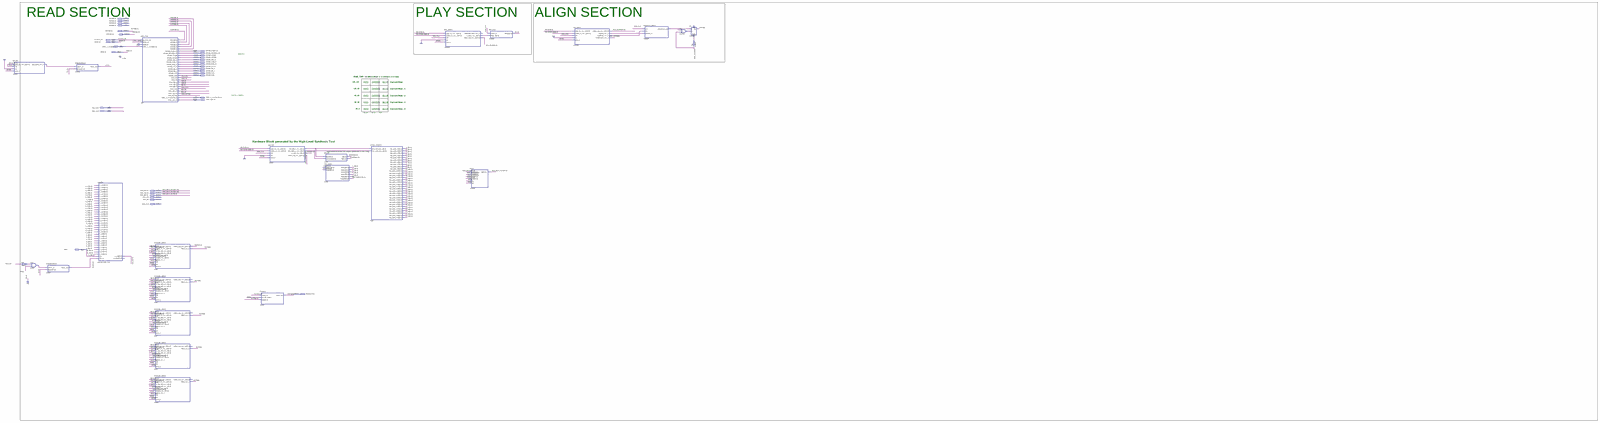
[diagram p0: schematic sheet, whole]
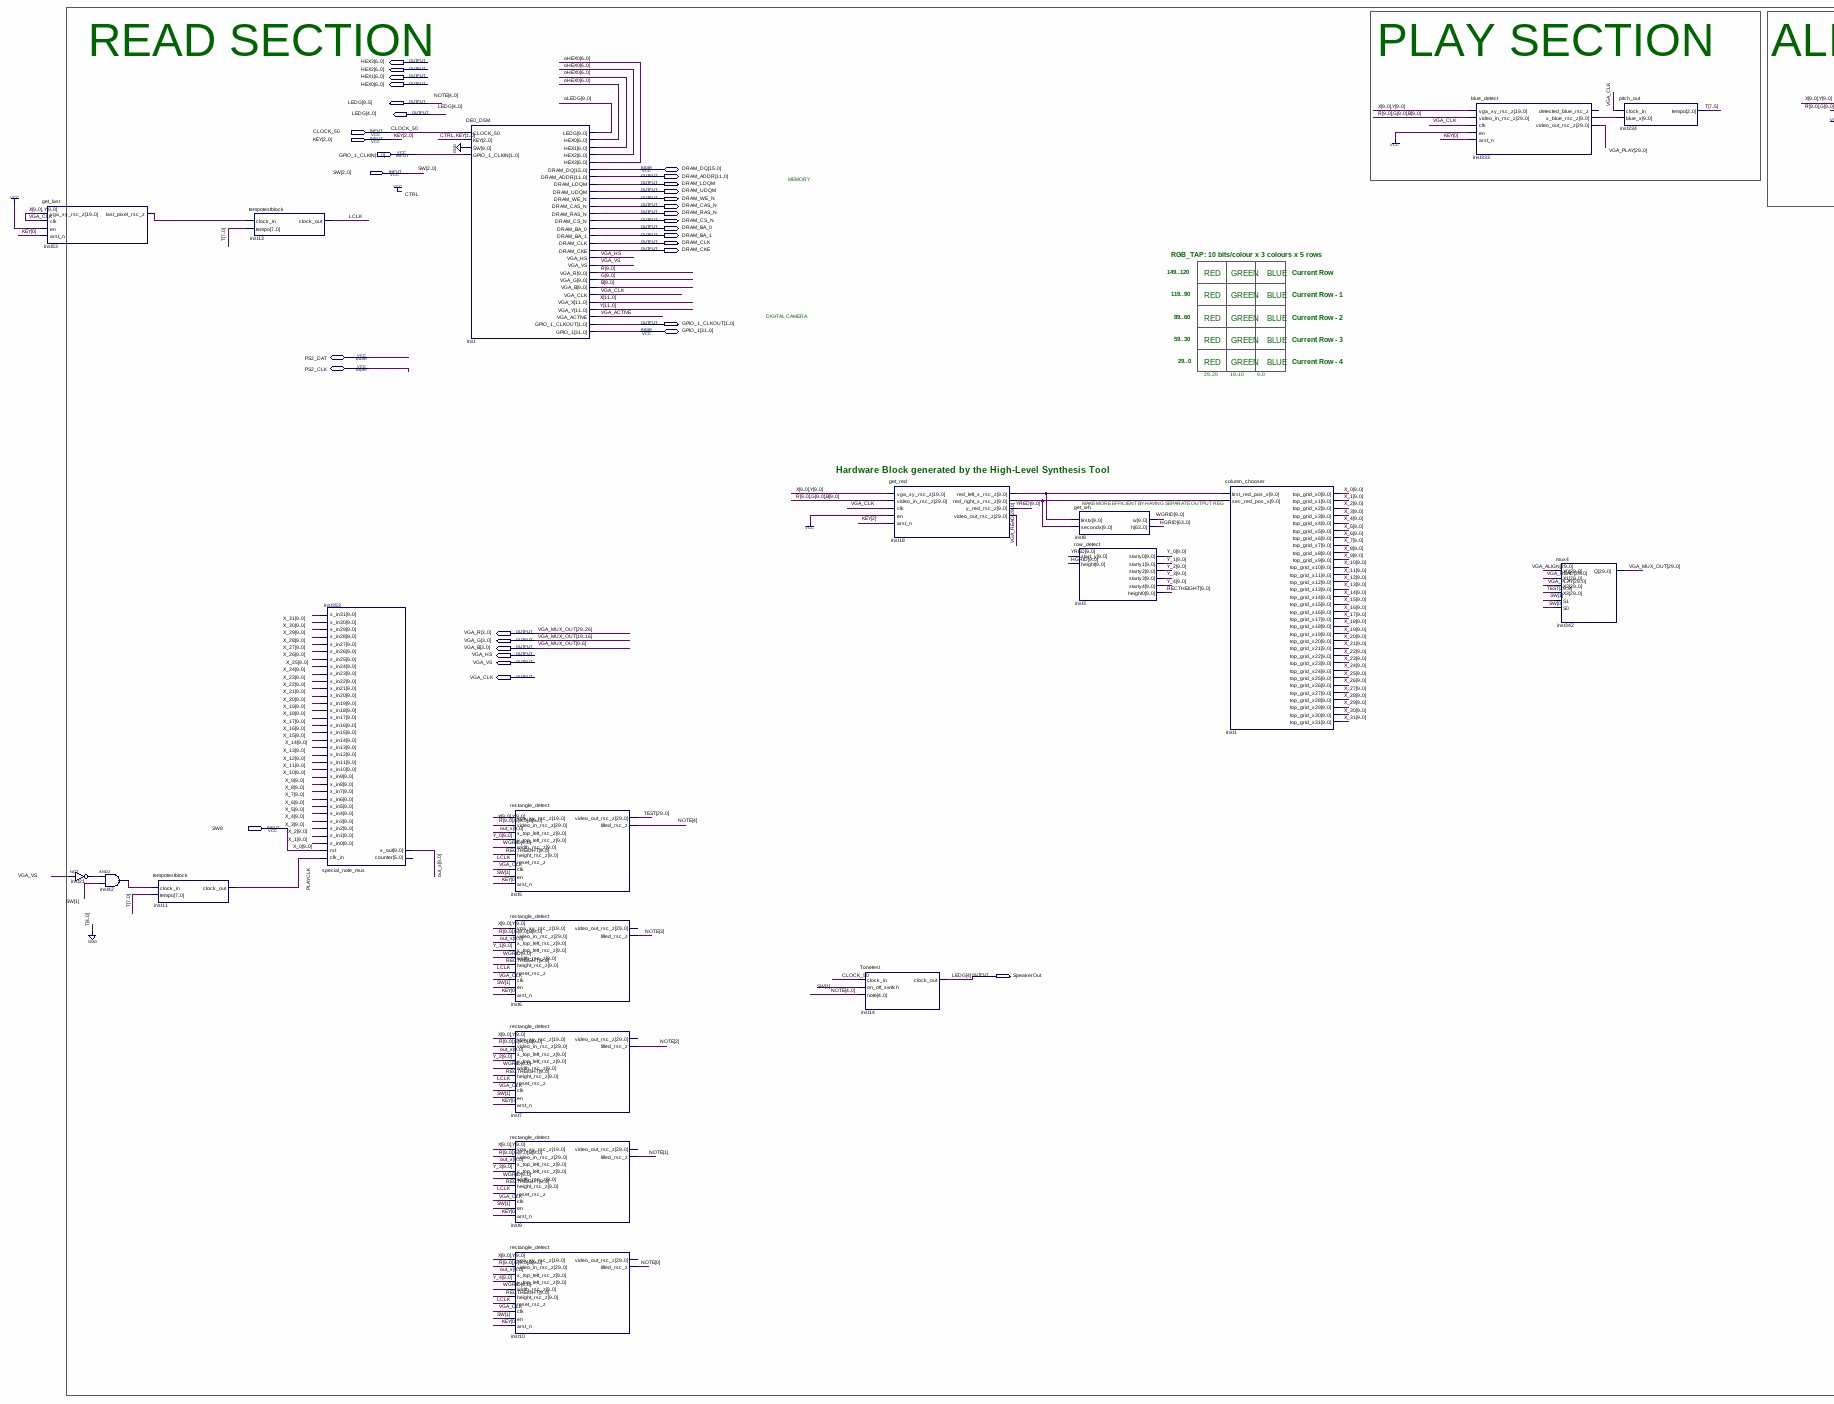
[diagram p1: schematic sheet, left part]
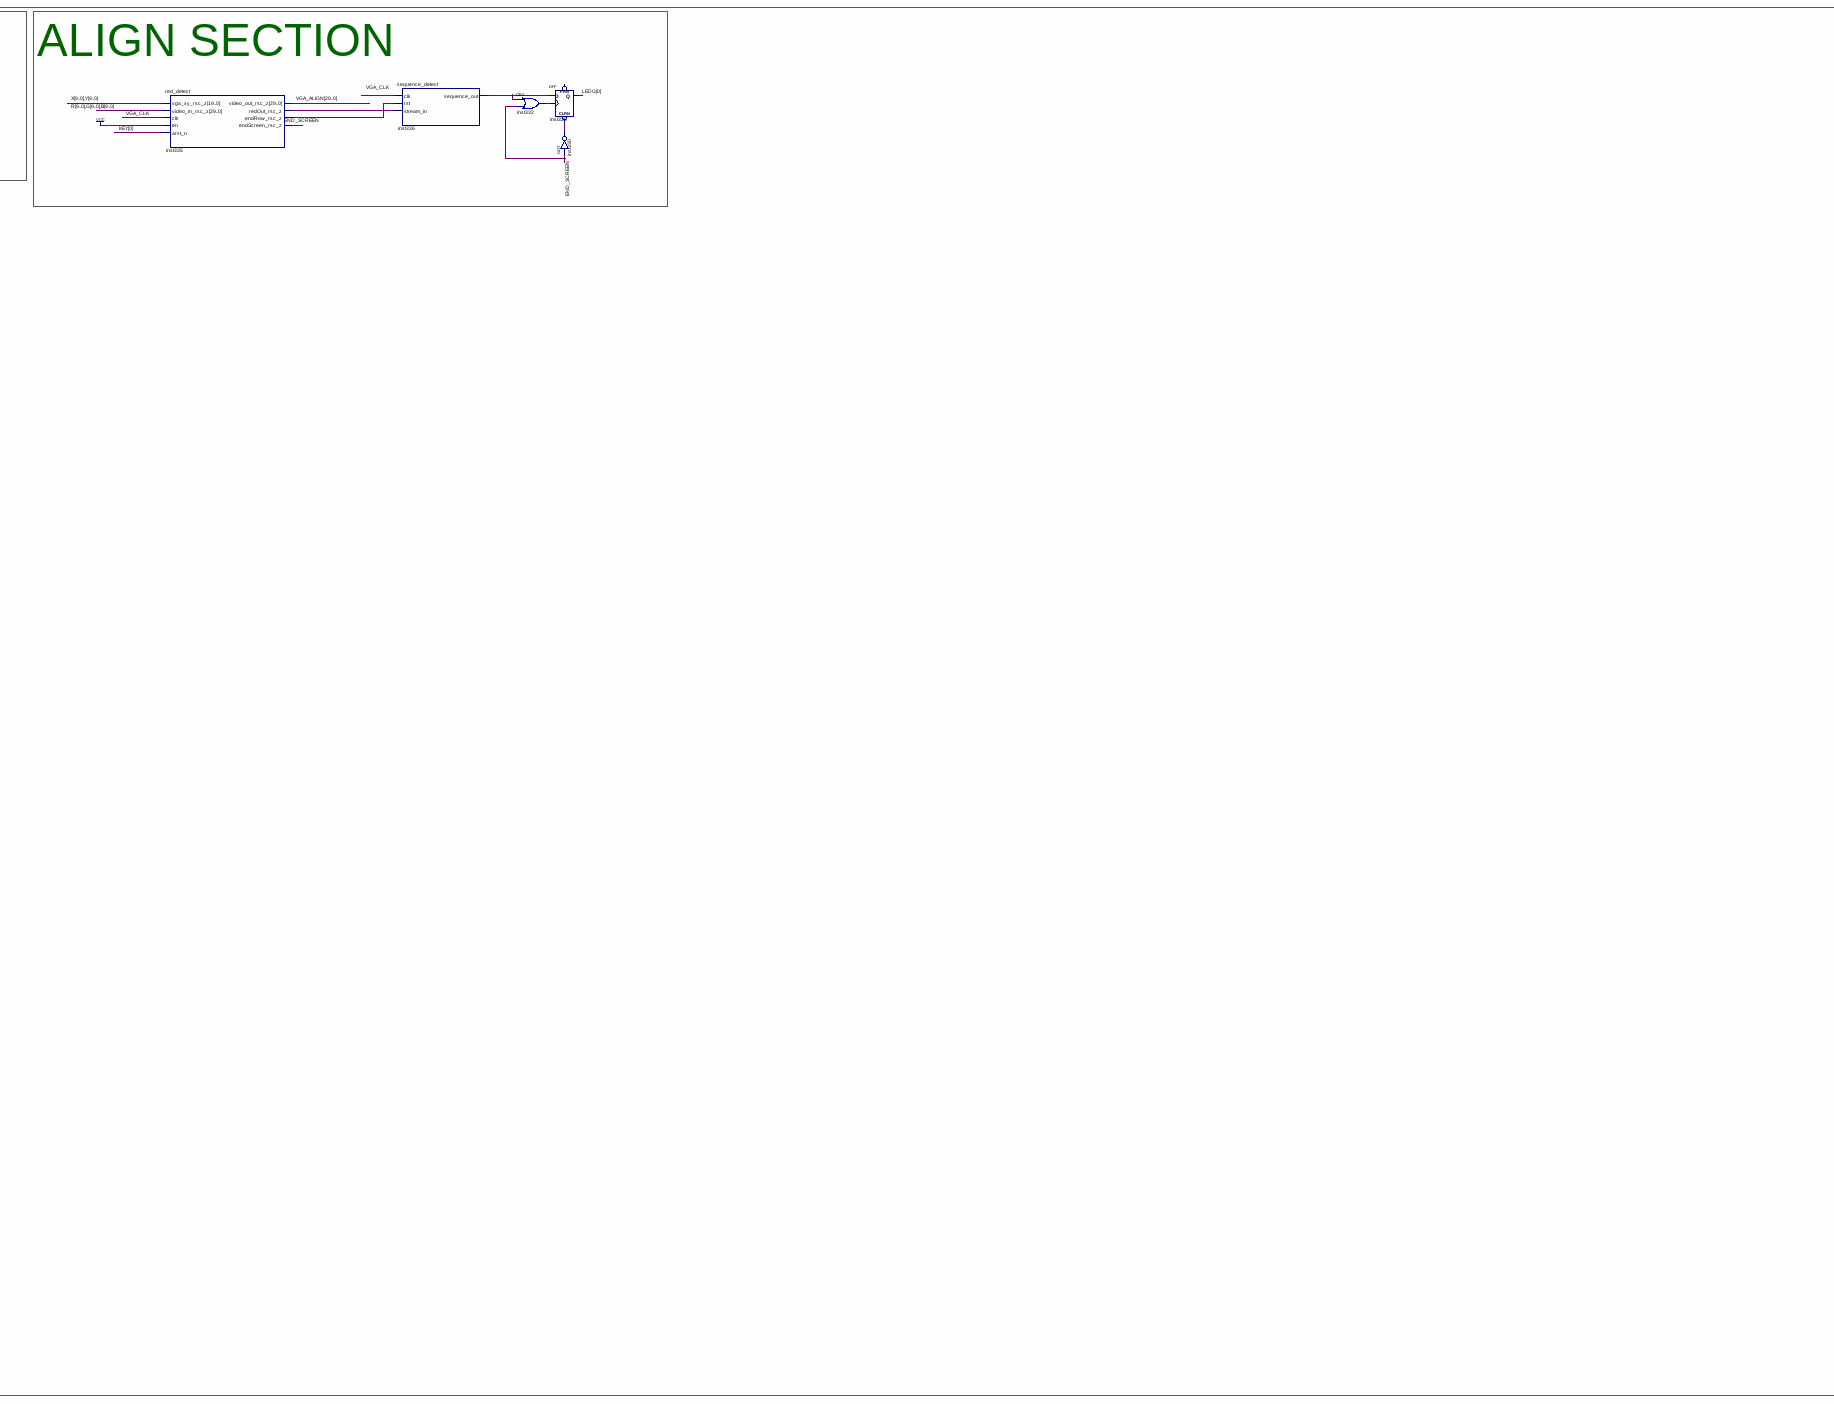
[diagram p2: schematic sheet, centre part]
// Quartus schematic TOP_DE0_CAMERA_MOUSE.bdf as structural Verilog: 25 symbols, 34 pins
module TOP_DE0_CAMERA_MOUSE (
  input  CLOCK_50,
  input  [2:0] KEY,
  input  [1:0] GPIO_1_CLKIN,
  input  [2:0] SW,
  input  SW8,
  inout  [15:0] DRAM_DQ,
  inout  [31:0] GPIO_1,
  inout  PS2_DAT,
  inout  PS2_CLK,
  output [6:0] HEX3,
  output [6:0] HEX2,
  output [6:0] HEX1,
  output [6:0] HEX0,
  output [9:0] LEDG,
  output [11:0] DRAM_ADDR,
  output DRAM_LDQM,
  output DRAM_UDQM,
  output DRAM_WE_N,
  output DRAM_CAS_N,
  output DRAM_RAS_N,
  output DRAM_CS_N,
  output DRAM_BA_0,
  output DRAM_BA_1,
  output DRAM_CLK,
  output DRAM_CKE,
  output [1:0] GPIO_1_CLKOUT,
  output [3:0] VGA_R,
  output [3:0] VGA_G,
  output [3:0] VGA_B,
  output VGA_HS,
  output VGA_VS,
  output VGA_CLK,
  output SpeakerOut
);

  wire END_SCREEN, inst21_out, inst42_out, inst53_last_pixel_rsc_z, inst330_out, inst332_out,
       inst335_endrow_rsc_z, inst335_redout_rsc_z, inst336_sequence_out, LCLK, PLAYCLK, VGA_ACTIVE;
  wire [6:0] oHEX0;
  wire [7:5] T;
  wire [9:0] B, G, inst18_red_left_x_rsc_z, inst18_red_right_x_rsc_z, inst333_x_blue_rsc_z, oLEDG, out_x, R,
       RECTHEIGHT, WGRID, X_0, X_1, X_2, X_3, X_4, X_5, X_6, X_7, X_8, X_9, X_10, X_11, X_12, X_13, X_14,
       X_15, X_16, X_17, X_18, X_19, X_20, X_21, X_22, X_23, X_24, X_25, X_26, X_27, X_28, X_29, X_30, X_31,
       Y_0, Y_1, Y_2, Y_3, Y_4, YRED;
  wire [11:0] X, Y;
  wire [25:0] VGA_MUX_OUT;
  wire [29:0] TEST, VGA_ALIGN, VGA_PLAY, VGA_READ;
  wire [63:0] HGRID;

  get_last inst53 (
    .vga_xy_rsc_z({X[9:0], Y[9:0]}), .clk(VGA_CLK), .en(1'b1), .arst_n(KEY[0]),
    .last_pixel_rsc_z(inst53_last_pixel_rsc_z));
  not inst21 (inst21_out, VGA_VS);
  and inst42 (inst42_out, inst21_out, SW[1]);
  tempotestblock inst11 (.clock_in(inst42_out), .tempo({T, {5{1'b0}}}), .clock_out(PLAYCLK));
  tempotestblock inst13 (.clock_in(inst53_last_pixel_rsc_z), .tempo({T, {5{1'b0}}}), .clock_out(LCLK));
  special_note_mux inst353 (
    .clk_in(PLAYCLK), .rst(SW8), .x_in0(X_0), .x_in1(X_1), .x_in2(X_2), .x_in3(X_3), .x_in4(X_4),
    .x_in5(X_5), .x_in6(X_6), .x_in7(X_7), .x_in8(X_8), .x_in9(X_9), .x_in10(X_10), .x_in11(X_11),
    .x_in12(X_12), .x_in13(X_13), .x_in14(X_14), .x_in15(X_15), .x_in16(X_16), .x_in17(X_17), .x_in18(X_18),
    .x_in19(X_19), .x_in20(X_20), .x_in21(X_21), .x_in22(X_22), .x_in23(X_23), .x_in24(X_24), .x_in25(X_25),
    .x_in26(X_26), .x_in27(X_27), .x_in28(X_28), .x_in29(X_29), .x_in30(X_30), .x_in31(X_31), .x_out(out_x));  // open: counter
  DE0_D5M inst (
    .CLOCK_50(CLOCK_50), .KEY({1'b1, KEY[1:0]}), .SW({10{1'b0}}), .GPIO_1_CLKIN(GPIO_1_CLKIN), .LEDG(oLEDG),
    .HEX0(oHEX0), .HEX1(oHEX0), .HEX2(oHEX0), .HEX3(oHEX0), .DRAM_ADDR(DRAM_ADDR), .DRAM_LDQM(DRAM_LDQM),
    .DRAM_UDQM(DRAM_UDQM), .DRAM_WE_N(DRAM_WE_N), .DRAM_CAS_N(DRAM_CAS_N), .DRAM_RAS_N(DRAM_RAS_N),
    .DRAM_CS_N(DRAM_CS_N), .DRAM_BA_0(DRAM_BA_0), .DRAM_BA_1(DRAM_BA_1), .DRAM_CLK(DRAM_CLK),
    .DRAM_CKE(DRAM_CKE), .VGA_HS(VGA_HS), .VGA_VS(VGA_VS), .VGA_R(R), .VGA_G(G), .VGA_B(B),
    .VGA_CLK(VGA_CLK), .VGA_X(X), .VGA_Y(Y), .VGA_ACTIVE(VGA_ACTIVE), .GPIO_1_CLKOUT(GPIO_1_CLKOUT),
    .DRAM_DQ(DRAM_DQ), .GPIO_1(GPIO_1));
  rectangle_detect inst5 (
    .vga_xy_rsc_z({X[9:0], Y[9:0]}), .video_in_rsc_z({R, G, B}), .x_top_left_rsc_z(out_x),
    .y_top_left_rsc_z(Y_0), .width_rsc_z(WGRID), .height_rsc_z(RECTHEIGHT), .reset_rsc_z(LCLK),
    .clk(VGA_CLK), .en(SW[1]), .arst_n(KEY[0]), .video_out_rsc_z(TEST), .filled_rsc_z(LEDG[9]));
  rectangle_detect inst6 (
    .vga_xy_rsc_z({X[9:0], Y[9:0]}), .video_in_rsc_z({R, G, B}), .x_top_left_rsc_z(out_x),
    .y_top_left_rsc_z(Y_1), .width_rsc_z(WGRID), .height_rsc_z(RECTHEIGHT), .reset_rsc_z(LCLK),
    .clk(VGA_CLK), .en(SW[1]), .arst_n(KEY[0]), .filled_rsc_z(LEDG[8]));  // open: video_out_rsc_z
  rectangle_detect inst7 (
    .vga_xy_rsc_z({X[9:0], Y[9:0]}), .video_in_rsc_z({R, G, B}), .x_top_left_rsc_z(out_x),
    .y_top_left_rsc_z(Y_2), .width_rsc_z(WGRID), .height_rsc_z(RECTHEIGHT), .reset_rsc_z(LCLK),
    .clk(VGA_CLK), .en(SW[1]), .arst_n(KEY[0]), .filled_rsc_z(LEDG[7]));  // open: video_out_rsc_z
  rectangle_detect inst9 (
    .vga_xy_rsc_z({X[9:0], Y[9:0]}), .video_in_rsc_z({R, G, B}), .x_top_left_rsc_z(out_x),
    .y_top_left_rsc_z(Y_3), .width_rsc_z(WGRID), .height_rsc_z(RECTHEIGHT), .reset_rsc_z(LCLK),
    .clk(VGA_CLK), .en(SW[1]), .arst_n(KEY[0]), .filled_rsc_z(LEDG[6]));  // open: video_out_rsc_z
  rectangle_detect inst10 (
    .vga_xy_rsc_z({X[9:0], Y[9:0]}), .video_in_rsc_z({R, G, B}), .x_top_left_rsc_z(out_x),
    .y_top_left_rsc_z(Y_4), .width_rsc_z(WGRID), .height_rsc_z(RECTHEIGHT), .reset_rsc_z(LCLK),
    .clk(VGA_CLK), .en(SW[1]), .arst_n(KEY[0]), .filled_rsc_z(LEDG[5]));  // open: video_out_rsc_z
  Tonetest inst14 (.clock_in(CLOCK_50), .on_off_switch(SW[1]), .note(LEDG[9:5]), .clock_out(LEDG[4]));
  get_red inst18 (
    .vga_xy_rsc_z({X[9:0], Y[9:0]}), .video_in_rsc_z({R, G, B}), .clk(VGA_CLK), .en(1'b1), .arst_n(KEY[2]),
    .red_left_x_rsc_z(inst18_red_left_x_rsc_z), .red_right_x_rsc_z(inst18_red_right_x_rsc_z),
    .y_red_rsc_z(YRED), .video_out_rsc_z(VGA_READ));
  get_wh inst8 (.firstx(inst18_red_left_x_rsc_z), .secondx(inst18_red_right_x_rsc_z), .w(WGRID), .h(HGRID));
  row_detect inst3 (
    .start_y(YRED), .height(HGRID[9:0]), .starty0(Y_0), .starty1(Y_1), .starty2(Y_2), .starty3(Y_3),
    .starty4(Y_4), .height0(RECTHEIGHT));
  column_chooser inst1 (
    .first_red_pos_x(inst18_red_left_x_rsc_z), .sec_red_pos_x(inst18_red_right_x_rsc_z), .top_grid_x0(X_0),
    .top_grid_x1(X_1), .top_grid_x2(X_2), .top_grid_x3(X_3), .top_grid_x4(X_4), .top_grid_x5(X_5),
    .top_grid_x6(X_6), .top_grid_x7(X_7), .top_grid_x8(X_8), .top_grid_x9(X_9), .top_grid_x10(X_10),
    .top_grid_x11(X_11), .top_grid_x12(X_12), .top_grid_x13(X_13), .top_grid_x14(X_14), .top_grid_x15(X_15),
    .top_grid_x16(X_16), .top_grid_x17(X_17), .top_grid_x18(X_18), .top_grid_x19(X_19), .top_grid_x20(X_20),
    .top_grid_x21(X_21), .top_grid_x22(X_22), .top_grid_x23(X_23), .top_grid_x24(X_24), .top_grid_x25(X_25),
    .top_grid_x26(X_26), .top_grid_x27(X_27), .top_grid_x28(X_28), .top_grid_x29(X_29), .top_grid_x30(X_30),
    .top_grid_x31(X_31));
  blue_detect inst333 (
    .vga_xy_rsc_z({X[9:0], Y[9:0]}), .video_in_rsc_z({R, G, B}), .clk(VGA_CLK), .en(1'b1), .arst_n(KEY[0]),
    .x_blue_rsc_z(inst333_x_blue_rsc_z), .video_out_rsc_z(VGA_PLAY));  // open: detected_blue_rsc_z
  mux4 inst342 (
    .X0(VGA_ALIGN), .X1(VGA_READ), .X2(VGA_PLAY), .X3(TEST), .S1(SW[1]), .S0(SW[0]),
    .Q({VGA_R, VGA_MUX_OUT[25:20], VGA_G, VGA_MUX_OUT[15:10], VGA_B, VGA_MUX_OUT[5:0]}));
  pitch_out inst334 (.clock_in(VGA_CLK), .blue_x(inst333_x_blue_rsc_z), .tempo(T));
  red_detect inst335 (
    .vga_xy_rsc_z({X[9:0], Y[9:0]}), .video_in_rsc_z({R, G, B}), .clk(VGA_CLK), .en(1'b1), .arst_n(KEY[0]),
    .video_out_rsc_z(VGA_ALIGN), .redOut_rsc_z(inst335_redout_rsc_z), .endRow_rsc_z(inst335_endrow_rsc_z),
    .endScreen_rsc_z(END_SCREEN));
  sequence_detect inst336 (
    .clk(VGA_CLK), .rst(inst335_endrow_rsc_z), .stream_in(inst335_redout_rsc_z),
    .sequence_out(inst336_sequence_out));
  or inst332 (inst332_out, inst336_sequence_out, END_SCREEN);
  DFF inst329 (.CLRN(inst330_out), .CLK(inst332_out), .D(inst336_sequence_out), .Q(LEDG[0]));  // open: PRN
  not inst330 (inst330_out, END_SCREEN);

  assign SpeakerOut = LEDG[4];

  // Other names for the same wires on the sheet: NOTE[4:0] = LEDG[9:5];
  //   VGA_MUX_OUT (some bits) = {VGA_R, VGA_G, VGA_B}

  // Notes on the sheet:
  //   READ SECTION
  //   PLAY SECTION
  //   ALIGN SECTION
  //   MEMORY
  //   RGB_TAP: 10 bits/colour x 3 colours x 5 rows
  //   149..120
  //   RED     GREEN    BLUE
  //   Current Row
  //   119..90
  //   RED     GREEN    BLUE
  //   Current Row - 1
  //   DIGITAL CAMERA
  //   89..60
  //   RED     GREEN    BLUE
  //   Current Row - 2
  //   59..30
  //   RED     GREEN    BLUE
  //   Current Row - 3
  //   29..0
  //   RED     GREEN    BLUE
  //   Current Row - 4
  //   29..20            19..10             9..0
  //   Hardware Block generated by the High-Level Synthesis Tool
  //   MAKE MORE EFFICIENT BY HAVING SEPARATE OUTPUT REG
endmodule
